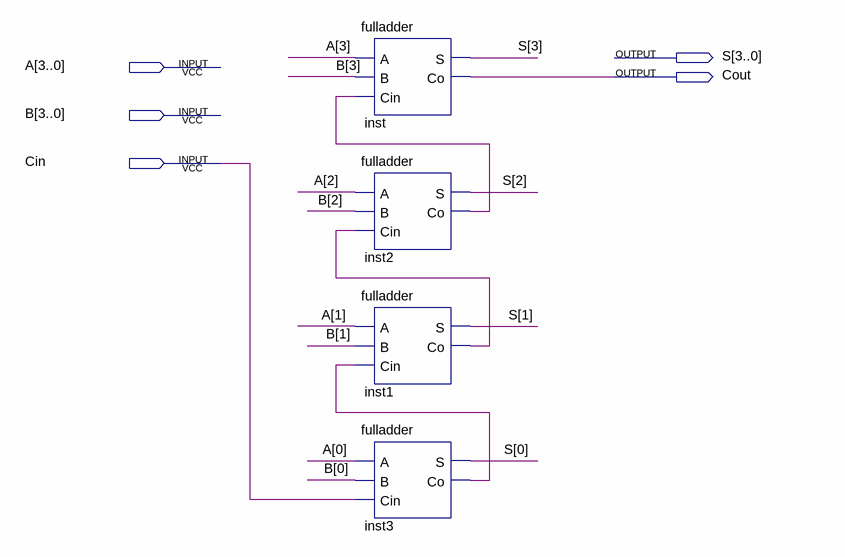
[diagram p0: schematic sheet]
// Quartus schematic adder4.bdf as structural Verilog: 4 symbols, 5 pins
module adder4 (
  input  [3:0] A,
  input  [3:0] B,
  input  Cin,
  output [3:0] S,
  output Cout
);

  wire inst1_co, inst2_co, inst3_co;

  fulladder inst (.A(A[3]), .B(B[3]), .Cin(inst2_co), .S(S[3]), .Co(Cout));
  fulladder inst2 (.A(A[2]), .B(B[2]), .Cin(inst1_co), .S(S[2]), .Co(inst2_co));
  fulladder inst1 (.A(A[1]), .B(B[1]), .Cin(inst3_co), .S(S[1]), .Co(inst1_co));
  fulladder inst3 (.A(A[0]), .B(B[0]), .Cin(Cin), .S(S[0]), .Co(inst3_co));
endmodule
